# Altium project adc_brd_raton_v0.PrjPcb
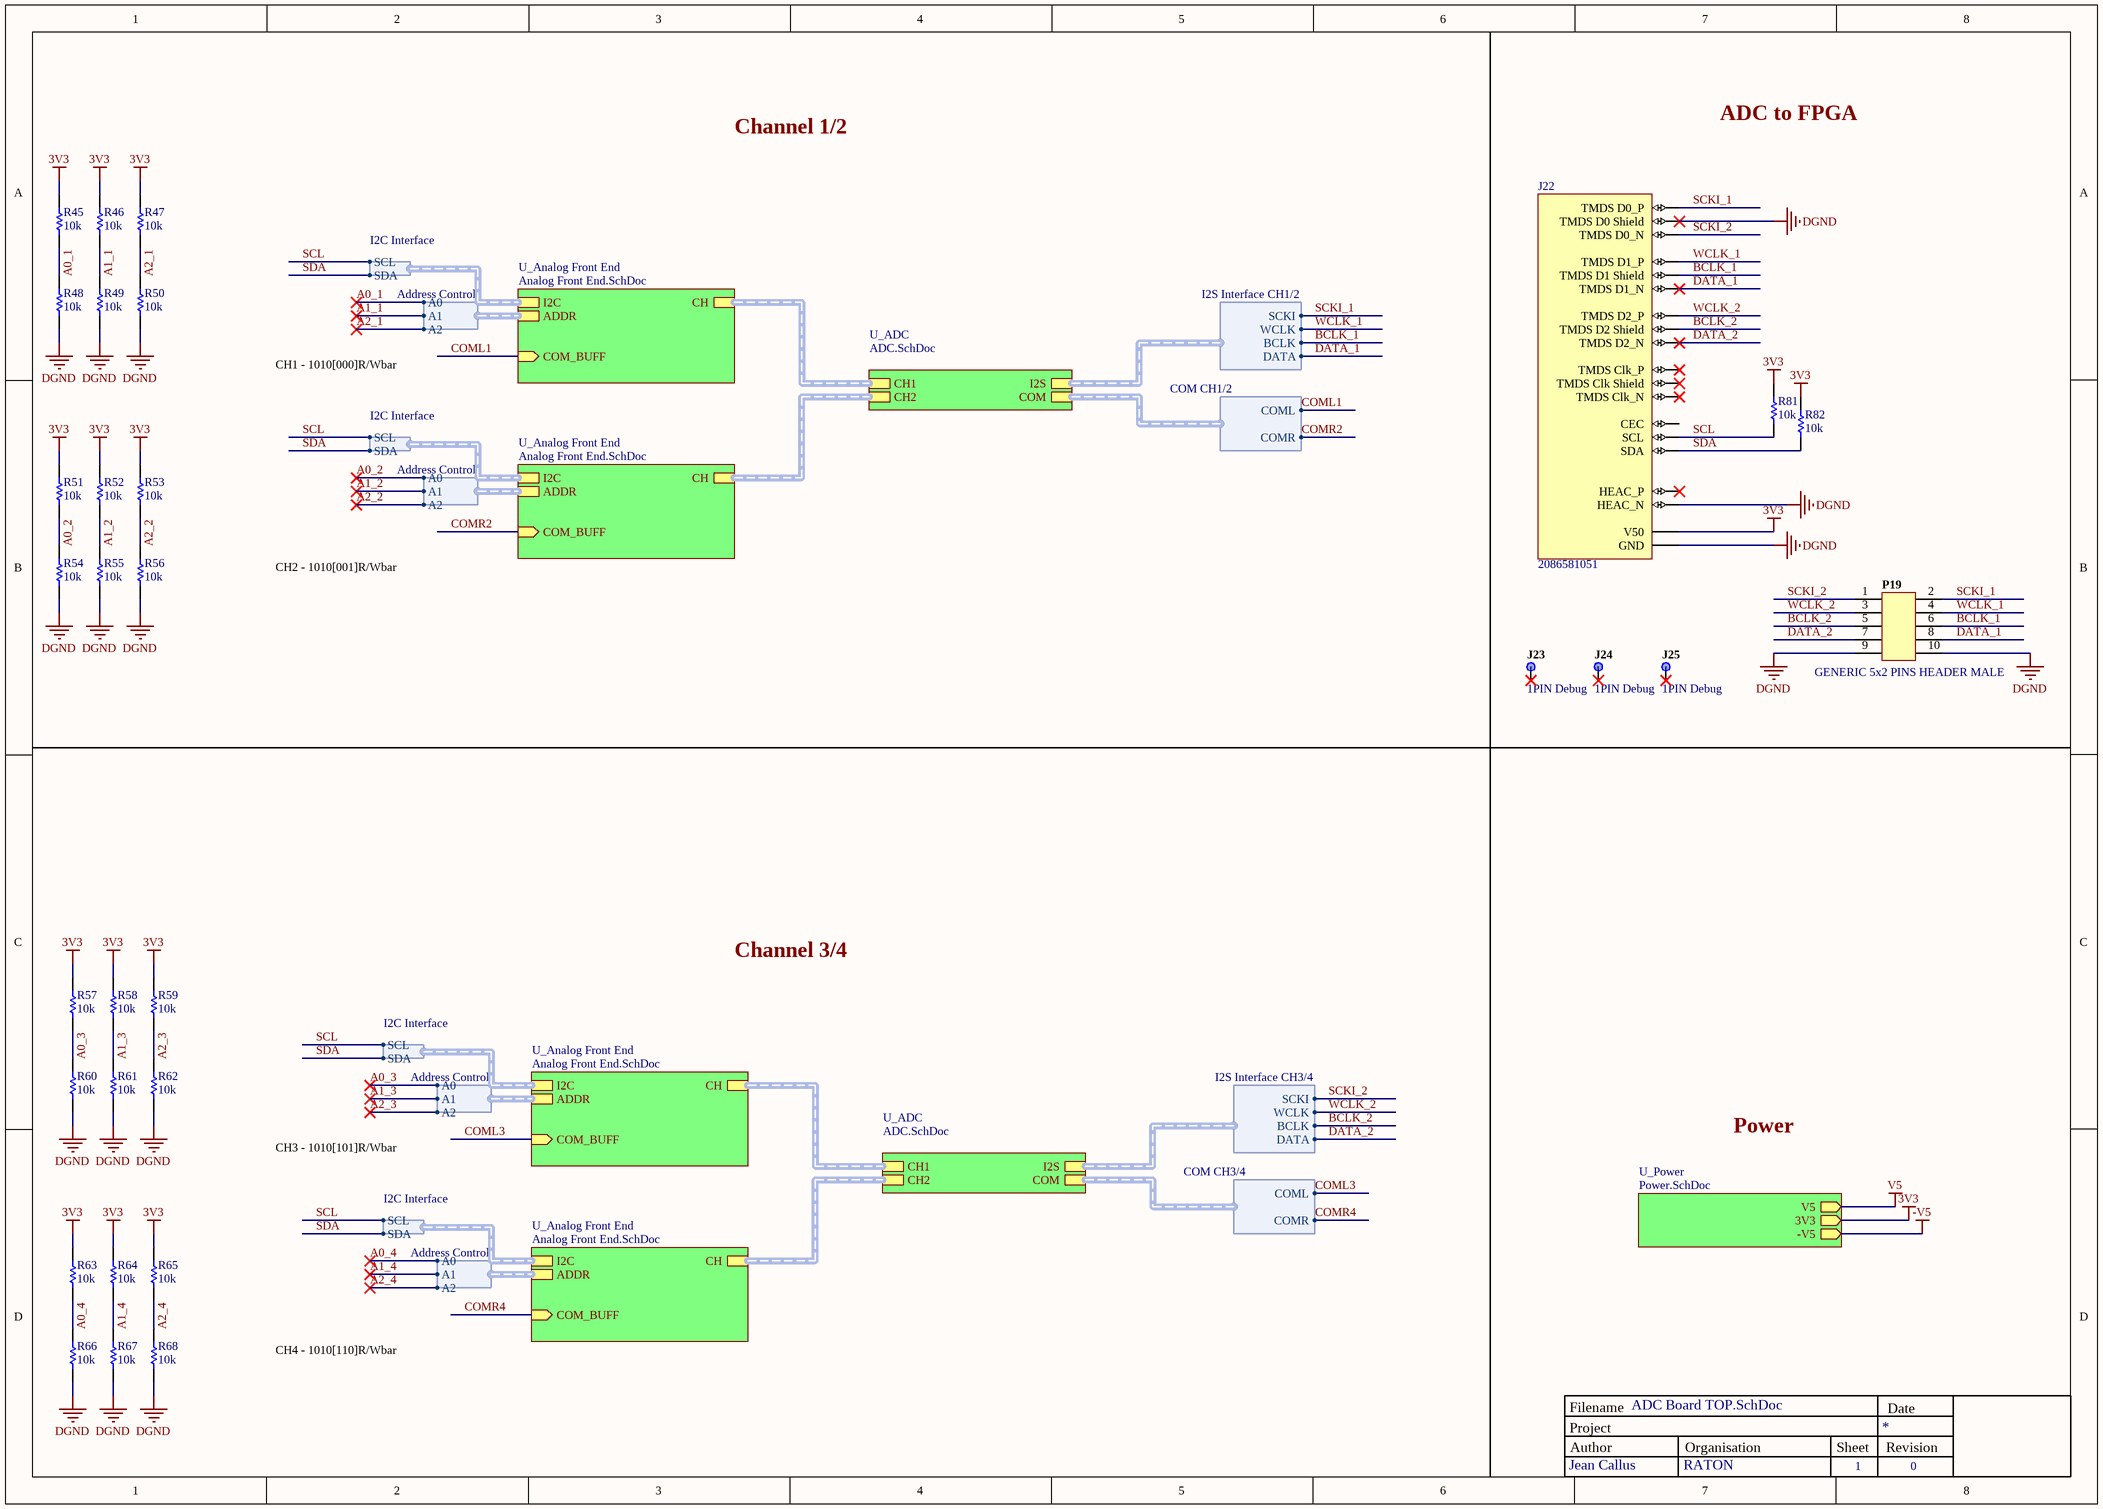
[diagram p0: ADC Board TOP.SchDoc]
4 sheets, 535 parts. Net scope: hierarchical (ports join the sheet entries above them; power ports are global).
Board file: adc_brd_raton_v0.PcbDoc
Sheets:
  ADC Board TOP.SchDoc
    U_Analog Front End = Analog Front End.SchDoc
    U_ADC = ADC.SchDoc
    U_Analog Front End = Analog Front End.SchDoc
    U_Power = Power.SchDoc
    U_Analog Front End = Analog Front End.SchDoc
    U_ADC = ADC.SchDoc
    U_Analog Front End = Analog Front End.SchDoc

## Sheet ADC Board TOP.SchDoc
size A3; Author: Jean Callus; Organization: RATON; Revision: 0; SheetNumber: 1

### Parts
J22  2086581051  [2086581051]
J23  1PIN Debug  [1 Pin Debug Port 0.9mm]
J24  1PIN Debug  [1 Pin Debug Port 0.9mm]
J25  1PIN Debug  [1 Pin Debug Port 0.9mm]
P19  GENERIC 5x2 PINS HEADER MALE  [GENERIC 5PIN 2ROW HEADER 0]
R45  value 10k  [0402-M]  (hidden comment: RES 10k 0402 63mW 5%)
R46  value 10k  [0402-M]  (hidden comment: RES 10k 0402 63mW 5%)
R47  value 10k  [0402-M]  (hidden comment: RES 10k 0402 63mW 5%)
R48  value 10k  [0402-M]  (hidden comment: RES 10k 0402 63mW 5%)
R49  value 10k  [0402-M]  (hidden comment: RES 10k 0402 63mW 5%)
R50  value 10k  [0402-M]  (hidden comment: RES 10k 0402 63mW 5%)
R51  value 10k  [0402-M]  (hidden comment: RES 10k 0402 63mW 5%)
R52  value 10k  [0402-M]  (hidden comment: RES 10k 0402 63mW 5%)
R53  value 10k  [0402-M]  (hidden comment: RES 10k 0402 63mW 5%)
R54  value 10k  [0402-M]  (hidden comment: RES 10k 0402 63mW 5%)
R55  value 10k  [0402-M]  (hidden comment: RES 10k 0402 63mW 5%)
R56  value 10k  [0402-M]  (hidden comment: RES 10k 0402 63mW 5%)
R57  value 10k  [0402-M]  (hidden comment: RES 10k 0402 63mW 5%)
R58  value 10k  [0402-M]  (hidden comment: RES 10k 0402 63mW 5%)
R59  value 10k  [0402-M]  (hidden comment: RES 10k 0402 63mW 5%)
R60  value 10k  [0402-M]  (hidden comment: RES 10k 0402 63mW 5%)
R61  value 10k  [0402-M]  (hidden comment: RES 10k 0402 63mW 5%)
R62  value 10k  [0402-M]  (hidden comment: RES 10k 0402 63mW 5%)
R63  value 10k  [0402-M]  (hidden comment: RES 10k 0402 63mW 5%)
R64  value 10k  [0402-M]  (hidden comment: RES 10k 0402 63mW 5%)
R65  value 10k  [0402-M]  (hidden comment: RES 10k 0402 63mW 5%)
R66  value 10k  [0402-M]  (hidden comment: RES 10k 0402 63mW 5%)
R67  value 10k  [0402-M]  (hidden comment: RES 10k 0402 63mW 5%)
R68  value 10k  [0402-M]  (hidden comment: RES 10k 0402 63mW 5%)
R81  value 10k  [0402-M]  (hidden comment: RES 10k 0402 63mW 5%)
R82  value 10k  [0402-M]  (hidden comment: RES 10k 0402 63mW 5%)

### Sub-sheets
U_ADC = ADC.SchDoc: I2S (harness I2S Interface CH1/2), CH1 (harness *), CH2 (harness *), COM (harness COM CH1/2)
U_ADC = ADC.SchDoc: I2S (harness I2S Interface CH3/4), CH1 (harness *), CH2 (harness *), COM (harness COM CH3/4)
U_Analog Front End = Analog Front End.SchDoc: COM_BUFF (in), CH (harness *), ADDR (harness Address Control), I2C (harness I2C Interface)
U_Analog Front End = Analog Front End.SchDoc: COM_BUFF (in), CH (harness *), ADDR (harness Address Control), I2C (harness I2C Interface)
U_Analog Front End = Analog Front End.SchDoc: COM_BUFF (in), CH (harness *), ADDR (harness Address Control), I2C (harness I2C Interface)
U_Analog Front End = Analog Front End.SchDoc: COM_BUFF (in), CH (harness *), ADDR (harness Address Control), I2C (harness I2C Interface)
U_Power = Power.SchDoc: V5 (out), 3V3 (out), -V5 (out)

### Harnesses
COM CH1/2: COML, COMR
COM CH3/4: COML, COMR
Address Control: A0, A1, A2
I2C Interface: SCL, SDA
I2S Interface CH1/2: SCKI, WCLK, BCLK, DATA
I2S Interface CH3/4: SCKI, WCLK, BCLK, DATA

### Nets
3V3: J22.18(V50) R45.2 R46.2 R47.2 R51.2 R52.2 R53.2 R57.2 R58.2 R59.2 R63.2 R64.2 R65.2 R81.2 R82.2 ; sheet U_Power/3V3
DGND: J22.8(TMDS_D0_Shield) J22.17(GND) J22.19(HEAC_N) P19.9 P19.10 R48.1 R49.1 R50.1 R54.1 R55.1 R56.1 R60.1 R61.1 R62.1 R66.1 R67.1 R68.1
A0_1: R45.1 R48.2 ; sheet U_Analog Front End/ADDR.A0  [project net A0]
A0_2: R51.1 R54.2 ; sheet U_Analog Front End/ADDR.A0  [project net A0]
A0_3: R57.1 R60.2 ; sheet U_Analog Front End/ADDR.A0  [project net A0]
A0_4: R63.1 R66.2 ; sheet U_Analog Front End/ADDR.A0  [project net A0]
A1_1: R46.1 R49.2 ; sheet U_Analog Front End/ADDR.A1  [project net A1]
A1_2: R52.1 R55.2 ; sheet U_Analog Front End/ADDR.A1  [project net A1]
A1_3: R58.1 R61.2 ; sheet U_Analog Front End/ADDR.A1  [project net A1]
A1_4: R64.1 R67.2 ; sheet U_Analog Front End/ADDR.A1  [project net A1]
A2_1: R47.1 R50.2 ; sheet U_Analog Front End/ADDR.A2  [project net A2]
A2_2: R53.1 R56.2 ; sheet U_Analog Front End/ADDR.A2  [project net A2]
A2_3: R59.1 R62.2 ; sheet U_Analog Front End/ADDR.A2  [project net A2]
A2_4: R65.1 R68.2 ; sheet U_Analog Front End/ADDR.A2  [project net A2]
BCLK_1: J22.5(TMDS_D1_Shield) P19.6 ; sheet U_ADC/I2S.BCLK  [project net BCLK]
BCLK_2: J22.2(TMDS_D2_Shield) P19.5 ; sheet U_ADC/I2S.BCLK  [project net BCLK]
COML1: sheet U_Analog Front End/COM_BUFF, sheet U_ADC/COM.COML  [project net COM]
COML3: sheet U_Analog Front End/COM_BUFF, sheet U_ADC/COM.COML  [project net COM]
COMR2: sheet U_Analog Front End/COM_BUFF, sheet U_ADC/COM.COMR  [project net COM]
COMR4: sheet U_Analog Front End/COM_BUFF, sheet U_ADC/COM.COMR  [project net COM]
DATA_1: J22.6(TMDS_D1_N) P19.8 ; sheet U_ADC/I2S.DATA  [project net DATA]
DATA_2: J22.3(TMDS_D2_N) P19.7 ; sheet U_ADC/I2S.DATA  [project net DATA]
SCKI_1: J22.7(TMDS_D0_P) P19.2 ; sheet U_ADC/I2S.SCKI  [project net SCKI]
SCKI_2: J22.9(TMDS_D0_N) P19.1 ; sheet U_ADC/I2S.SCKI  [project net SCKI]
SCL: J22.15(SCL) R81.1 ; sheet U_Analog Front End/I2C.SCL
SDA: J22.16(SDA) R82.1 ; sheet U_Analog Front End/I2C.SDA
WCLK_1: J22.4(TMDS_D1_P) P19.4 ; sheet U_ADC/I2S.WCLK  [project net WCLK]
WCLK_2: J22.1(TMDS_D2_P) P19.3 ; sheet U_ADC/I2S.WCLK  [project net WCLK]

Not connected (* = marked no-connect by the designer): J22 10(TMDS_Clk_P)* 11(TMDS_Clk_Shield)* 12(TMDS_Clk_N)* 13(CEC) 14(HEAC_P)*; J23 1*; J24 1*; J25 1*

### Buses and harness runs
harness sheet U_ADC/CH1 = sheet U_Analog Front End/CH
harness sheet U_ADC/CH2 = sheet U_Analog Front End/CH

### Notes on the sheet
- Channel 1/2
- ADC to FPGA
- CH1 - 1010[000]R/Wbar
- CH2 - 1010[001]R/Wbar
- Channel 3/4
- CH3 - 1010[101]R/Wbar
- Power
- CH4 - 1010[110]R/Wbar
- Project
- Filename
- Author
- Organisation
- Sheet
- Revision
- Date
  Date

### Library data of the parts
J22 = 2086581051-2: CONN FEM SMD 19 90Deg HDMI; Manufacturer: Molex; Status: Active; Supplier 1: Mouser; Source: Connector Library.SchLib; Design Item ID: 2086581051; Bin: *; Supplier Part Number 1: Mouser; Type: HYBRID; Case/Package: 4 PIN
J23-J25 = 1PIN Debug-2: CONN MAL TH 1 0Deg HEADER; Status: NC; Case/Package: 1 PIN; Source: Connector Library.SchLib; Type: N/A; Design Item ID: 1PIN Debug
P19 = GENERIC 5x2 PINS HEADER MALE-2: CONN MAL TH 5x2 0Deg HEADER; Bin: B3-J5; Status: Active; Case/Package: 2 PIN; Source: Connector Library.SchLib; Type: TH; Design Item ID: GENERIC 5x2 PINS HEADER MALE; Manufacturer: Generic
R45-R68 R81 R82 = RES 10k 0402 63mW 5%-1: RES-10k-0402-63mW-5%; Manufacturer: Generic; Bin: F1-R7-9; MAPPING: 1(2,1,11.5k); Design Item ID: RES 10k 0402 63mW 5%; Type: SMD; Status: Active; Case/Package: 0402; Source: Resistor Library.SchLib

## Sheet Analog Front End.SchDoc
size A3; Author: Jean Callus; CompanyName: RATON; DrawnBy: Jean Callus; Organization: RATON; Revision: 0; SheetNumber: 4; SheetTotal: 4; ImagePath: C:\Users\callu\Documents\University\Thesis\Misc\UoMLogo.jpg
Used 4 times, as channels U_Analog Front End, U_Analog Front End, U_Analog Front End, U_Analog Front End. Parts and nets are listed once, with the designators drawn on the sheet.
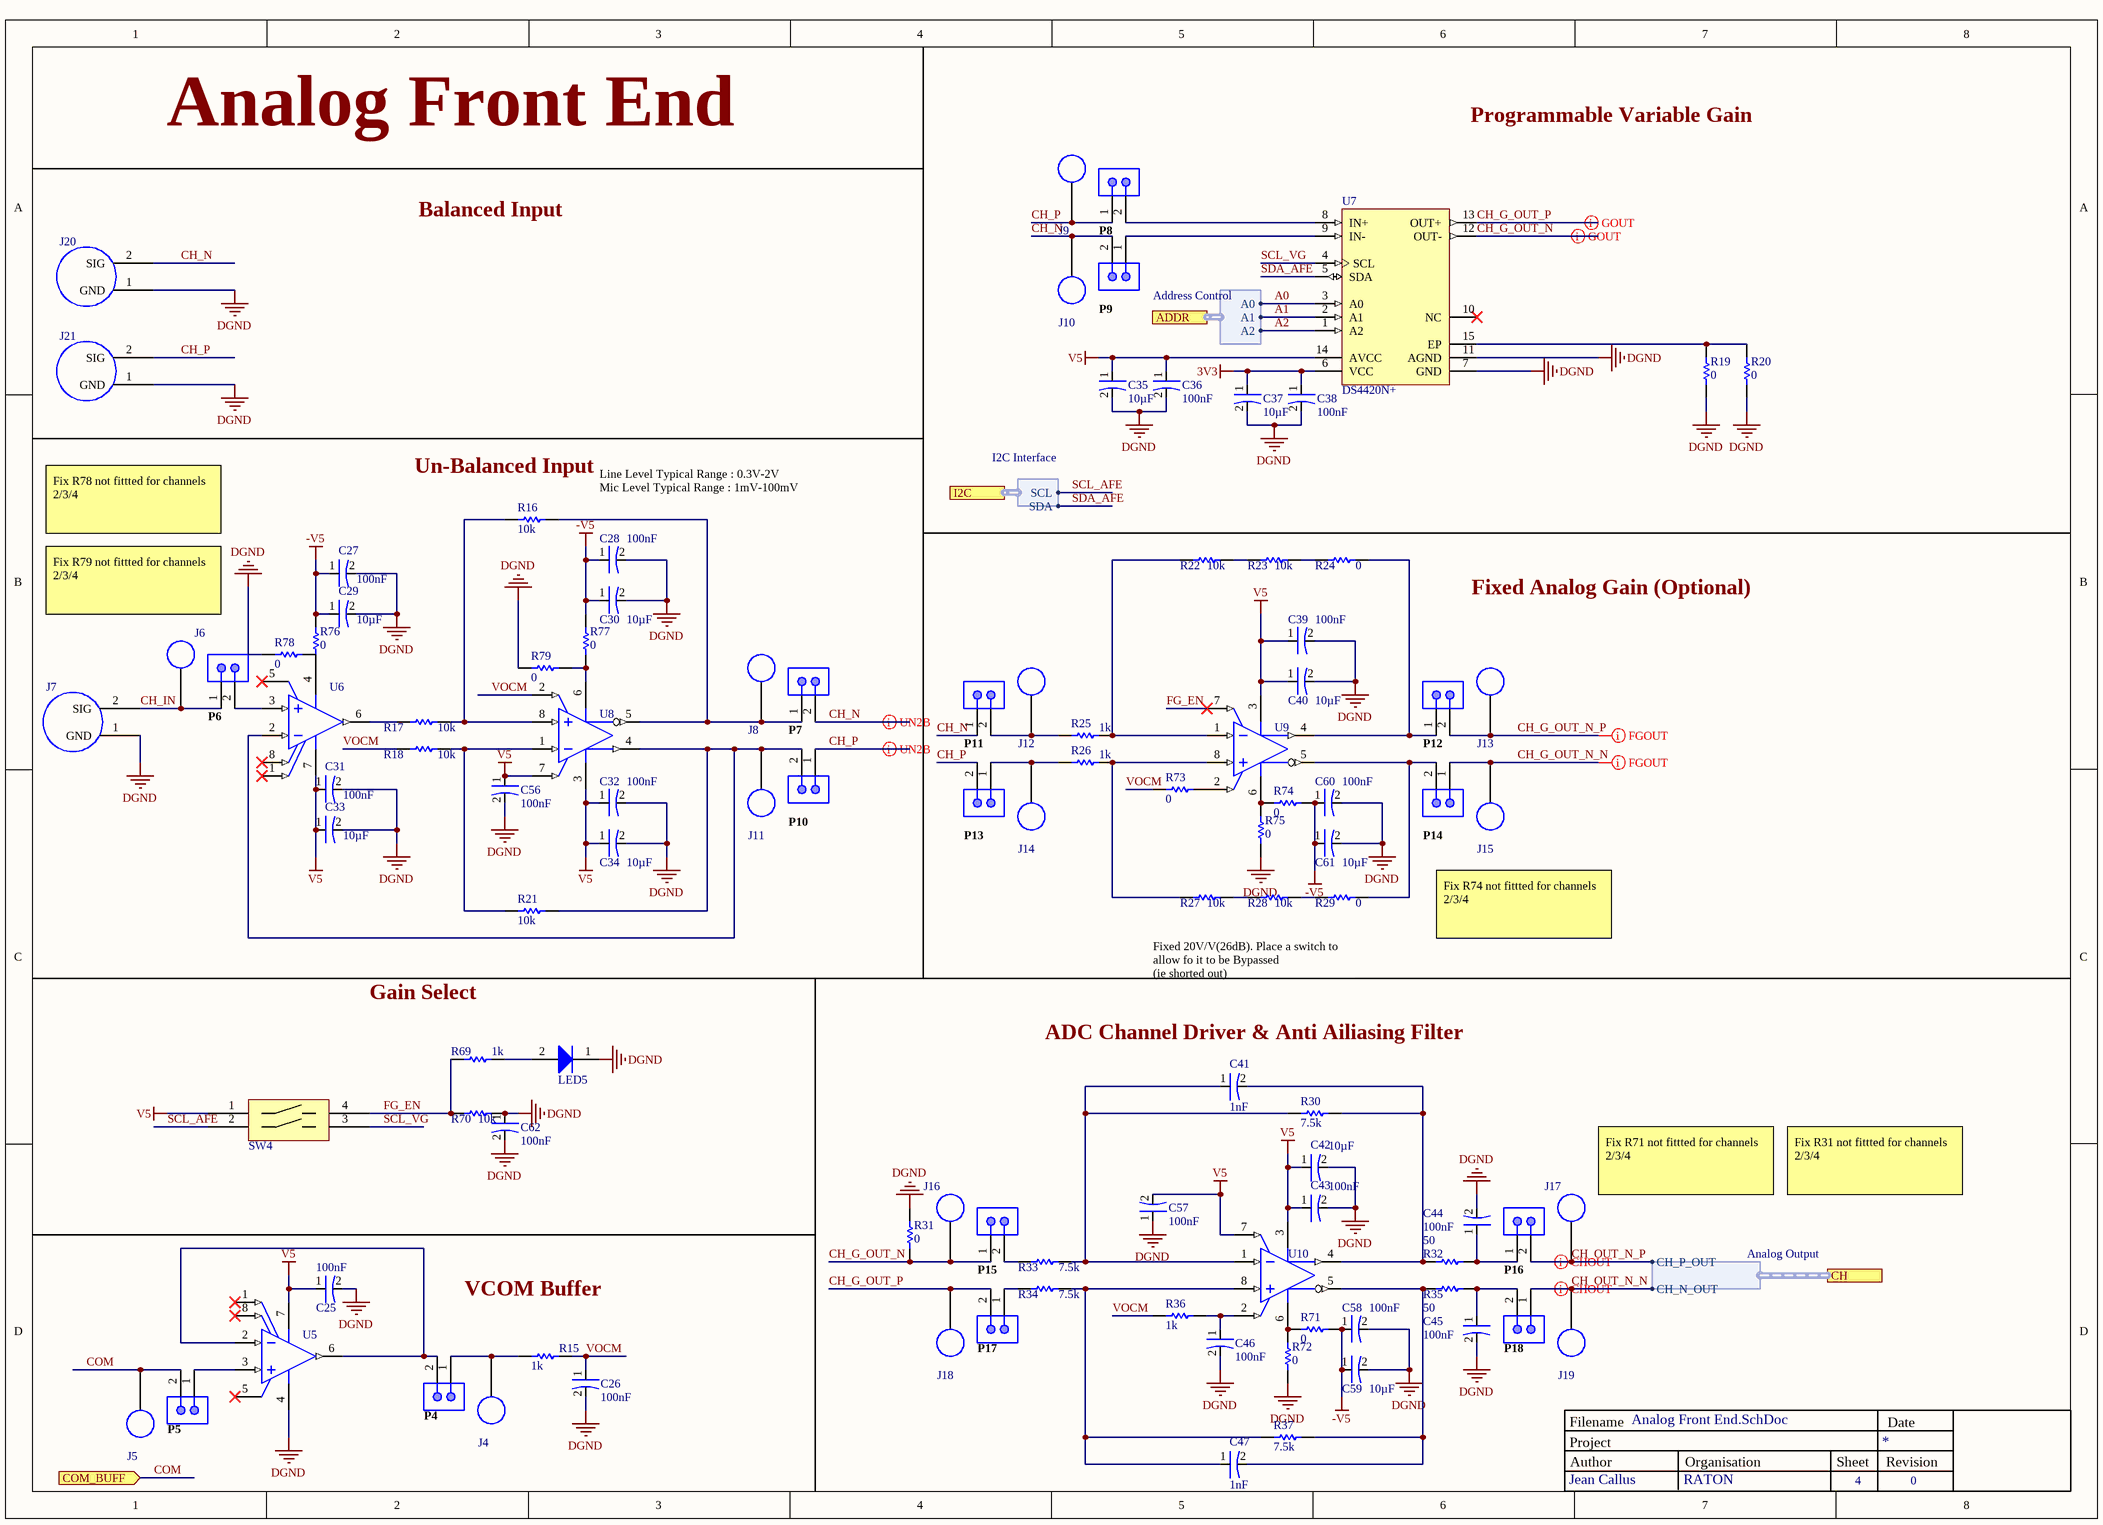
[diagram p1: Analog Front End.SchDoc]

### Parts
C25  value 100nF  [0805-M]  (hidden comment: CAP 0.1uF CER 0805 50V  X7R 5%)
C26  value 100nF  [0805-M]  (hidden comment: CAP 0.1uF CER 0805 50V  X7R 5%)
C27  value 100nF  [0805-M]  (hidden comment: CAP 0.1uF CER 0805 50V  X7R 5%)
C28  value 100nF  [0805-M]  (hidden comment: CAP 0.1uF CER 0805 50V  X7R 5%)
C29  value 10µF  [0805-M]  (hidden comment: CAP 10uF CER 0805 25V X5R 10%)
C30  value 10µF  [0805-M]  (hidden comment: CAP 10uF CER 0805 25V X5R 10%)
C31  value 100nF  [0805-M]  (hidden comment: CAP 0.1uF CER 0805 50V  X7R 5%)
C32  value 100nF  [0805-M]  (hidden comment: CAP 0.1uF CER 0805 50V  X7R 5%)
C33  value 10µF  [0805-M]  (hidden comment: CAP 10uF CER 0805 25V X5R 10%)
C34  value 10µF  [0805-M]  (hidden comment: CAP 10uF CER 0805 25V X5R 10%)
C35  value 10µF  [0805-M]  (hidden comment: CAP 10uF CER 0805 25V X5R 10%)
C36  value 100nF  [0805-M]  (hidden comment: CAP 0.1uF CER 0805 50V  X7R 5%)
C37  value 10µF  [0805-M]  (hidden comment: CAP 10uF CER 0805 25V X5R 10%)
C38  value 100nF  [0805-M]  (hidden comment: CAP 0.1uF CER 0805 50V  X7R 5%)
C39  value 100nF  [0805-M]  (hidden comment: CAP 0.1uF CER 0805 50V  X7R 5%)
C40  value 10µF  [0805-M]  (hidden comment: CAP 10uF CER 0805 25V X5R 10%)
C41  value 1nF  [0805-M]  (hidden comment: CAP 1nF CER 0805 25V X7R 5%)
C42  value 10µF  [0805-M]  (hidden comment: CAP 10uF CER 0805 25V X5R 10%)
C43  value 100nF  [0805-M]  (hidden comment: CAP 0.1uF CER 0805 50V  X7R 5%)
C44  value 100nF  [0805-M]  (hidden comment: CAP 0.1uF CER 0805 50V  X7R 5%)
C45  value 100nF  [0805-M]  (hidden comment: CAP 0.1uF CER 0805 50V  X7R 5%)
C46  value 100nF  [0805-M]  (hidden comment: CAP 0.1uF CER 0805 50V  X7R 5%)
C47  value 1nF  [0805-M]  (hidden comment: CAP 1nF CER 0805 25V X7R 5%)
C56  value 100nF  [0805-M]  (hidden comment: CAP 0.1uF CER 0805 50V  X7R 5%)
C57  value 100nF  [0805-M]  (hidden comment: CAP 0.1uF CER 0805 50V  X7R 5%)
C58  value 100nF  [0805-M]  (hidden comment: CAP 0.1uF CER 0805 50V  X7R 5%)
C59  value 10µF  [0805-M]  (hidden comment: CAP 10uF CER 0805 25V X5R 10%)
C60  value 100nF  [0805-M]  (hidden comment: CAP 0.1uF CER 0805 50V  X7R 5%)
C61  value 10µF  [0805-M]  (hidden comment: CAP 10uF CER 0805 25V X5R 10%)
C62  value 100nF  [0805-M]  (hidden comment: CAP 0.1uF CER 0805 50V  X7R 5%)
J4  151-203-RC  [151-203-RC-Footprint-1]  (value not drawn)
J5  151-203-RC  [151-203-RC-Footprint-1]  (value not drawn)
J6  151-203-RC  [151-203-RC-Footprint-1]  (value not drawn)
J7  SMA CONNECTOR  [SMA CONNECTOR-Footprint-1]  (value not drawn)
J8  151-203-RC  [151-203-RC-Footprint-1]  (value not drawn)
J9  151-203-RC  [151-203-RC-Footprint-1]  (value not drawn)
J10  151-203-RC  [151-203-RC-Footprint-1]  (value not drawn)
J11  151-203-RC  [151-203-RC-Footprint-1]  (value not drawn)
J12  151-203-RC  [151-203-RC-Footprint-1]  (value not drawn)
J13  151-203-RC  [151-203-RC-Footprint-1]  (value not drawn)
J14  151-203-RC  [151-203-RC-Footprint-1]  (value not drawn)
J15  151-203-RC  [151-203-RC-Footprint-1]  (value not drawn)
J16  151-203-RC  [151-203-RC-Footprint-1]  (value not drawn)
J17  151-203-RC  [151-203-RC-Footprint-1]  (value not drawn)
J18  151-203-RC  [151-203-RC-Footprint-1]  (value not drawn)
J19  151-203-RC  [151-203-RC-Footprint-1]  (value not drawn)
J20  SMA CONNECTOR  [SMA CONNECTOR-Footprint-1]  (value not drawn)
J21  SMA CONNECTOR  [SMA CONNECTOR-Footprint-1]  (value not drawn)
LED5  LED 0603 Red 20mA 1.7V  [0603 Generic]  (value not drawn)
P4  GENERIC 2PIN HEADER MALE  [GENERIC 2PIN HEADER 0]  (value not drawn)
P5  GENERIC 2PIN HEADER MALE  [GENERIC 2PIN HEADER 0]  (value not drawn)
P6  GENERIC 2PIN HEADER MALE  [GENERIC 2PIN HEADER 0]  (value not drawn)
P7  GENERIC 2PIN HEADER MALE  [GENERIC 2PIN HEADER 0]  (value not drawn)
P8  GENERIC 2PIN HEADER MALE  [GENERIC 2PIN HEADER 0]  (value not drawn)
P9  GENERIC 2PIN HEADER MALE  [GENERIC 2PIN HEADER 0]  (value not drawn)
P10  GENERIC 2PIN HEADER MALE  [GENERIC 2PIN HEADER 0]  (value not drawn)
P11  GENERIC 2PIN HEADER MALE  [GENERIC 2PIN HEADER 0]  (value not drawn)
P12  GENERIC 2PIN HEADER MALE  [GENERIC 2PIN HEADER 0]  (value not drawn)
P13  GENERIC 2PIN HEADER MALE  [GENERIC 2PIN HEADER 0]  (value not drawn)
P14  GENERIC 2PIN HEADER MALE  [GENERIC 2PIN HEADER 0]  (value not drawn)
P15  GENERIC 2PIN HEADER MALE  [GENERIC 2PIN HEADER 0]  (value not drawn)
P16  GENERIC 2PIN HEADER MALE  [GENERIC 2PIN HEADER 0]  (value not drawn)
P17  GENERIC 2PIN HEADER MALE  [GENERIC 2PIN HEADER 0]  (value not drawn)
P18  GENERIC 2PIN HEADER MALE  [GENERIC 2PIN HEADER 0]  (value not drawn)
R15  value 1k  [0805-M]  (hidden comment: RES 1k 0805 125mW 5%)
R16  value 10k  [0402-M]  (hidden comment: RES 10k 0402 63mW 5%)
R17  value 10k  [0402-M]  (hidden comment: RES 10k 0402 63mW 5%)
R18  value 10k  [0402-M]  (hidden comment: RES 10k 0402 63mW 5%)
R19  value 0  [0402-M]  (hidden comment: RES 0 0402 63mW)
R20  value 0  [0402-M]  (hidden comment: RES 0 0402 63mW)
R21  value 10k  [0402-M]  (hidden comment: RES 10k 0402 63mW 5%)
R22  value 10k  [0805-M]  (hidden comment: RES 10k 0805 125mW 1%)
R23  value 10k  [0805-M]  (hidden comment: RES 10k 0805 125mW 1%)
R24  value 0  [0402-M]  (hidden comment: RES 0 0402 63mW)
R25  value 1k  [0805-M]  (hidden comment: RES 1k 0805 125mW 5%)
R26  value 1k  [0805-M]  (hidden comment: RES 1k 0805 125mW 5%)
R27  value 10k  [0805-M]  (hidden comment: RES 10k 0805 125mW 1%)
R28  value 10k  [0805-M]  (hidden comment: RES 10k 0805 125mW 1%)
R29  value 0  [0402-M]  (hidden comment: RES 0 0402 63mW)
R30  value 7.5k  [0402-M]  (hidden comment: RES 7.5k 0402 63mW 5%)
R31  value 0  [0402-M]  (hidden comment: RES 0 0402 63mW)
R32  value 50  [0805-L]  (hidden comment: RES 50 0805 125mW 1%)
R33  value 7.5k  [0402-M]  (hidden comment: RES 7.5k 0402 63mW 5%)
R34  value 7.5k  [0402-M]  (hidden comment: RES 7.5k 0402 63mW 5%)
R35  value 50  [0805-L]  (hidden comment: RES 50 0805 125mW 1%)
R36  value 1k  [0805-M]  (hidden comment: RES 1k 0805 125mW 5%)
R37  value 7.5k  [0402-M]  (hidden comment: RES 7.5k 0402 63mW 5%)
R69  value 1k  [0805-M]  (hidden comment: RES 1k 0805 125mW 5%)
R70  value 10k  [0805-M]  (hidden comment: RES 10k 0805 125mW 1%)
R71  value 0  [0402-M]  (hidden comment: RES 0 0402 63mW)
R72  value 0  [0402-M]  (hidden comment: RES 0 0402 63mW)
R73  value 0  [0402-M]  (hidden comment: RES 0 0402 63mW)
R74  value 0  [0402-M]  (hidden comment: RES 0 0402 63mW)
R75  value 0  [0402-M]  (hidden comment: RES 0 0402 63mW)
R76  value 0  [0402-M]  (hidden comment: RES 0 0402 63mW)
R77  value 0  [0402-M]  (hidden comment: RES 0 0402 63mW)
R78  value 0  [0402-M]  (hidden comment: RES 0 0402 63mW)
R79  value 0  [0402-M]  (hidden comment: RES 0 0402 63mW)
SW4  210-2MS  [210-2MS-Footprint-1]  (value not drawn)
U5  OPA227UA/2K5  [D0008A_L]  (value not drawn)
U6  OPA227UA/2K5  [D0008A_L]  (value not drawn)
U7  DS4420N+  [QFN50P400X300X75_HS-15N]
U8  OPA1632DR  [D0008A_L]  (value not drawn)
U9  OPA1632DR  [D0008A_L]  (value not drawn)
U10  OPA1632DR  [D0008A_L]  (value not drawn)

### Ports
ADDR (harness Address Control), CH (harness Analog Output), COM_BUFF (in), I2C (harness I2C Interface)

### Harnesses
Analog Output: CH_P_OUT, CH_N_OUT
Address Control: A0, A1, A2
I2C Interface: SCL, SDA

### Nets
3V3: C37.1(Anode) C38.1(Anode) U7.6(VCC)
-V5: C27.1(Anode) C28.1(Anode) C29.1(Anode) C30.1(Anode) C58.1(Anode) C59.1(Anode) C60.1(Anode) C61.1(Anode) R71.2 R74.1 R76.1 R77.2
DGND: C25.2(Cathode) C26.2(Cathode) C27.2(Cathode) C28.2(Cathode) C29.2(Cathode) C30.2(Cathode) C31.2(Cathode) C32.2(Cathode) C33.2(Cathode) C34.2(Cathode) C35.2(Cathode) C36.2(Cathode) C37.2(Cathode) C38.2(Cathode) C39.2(Cathode) C40.2(Cathode) C42.2(Cathode) C43.2(Cathode) C44.2(Cathode) C45.2(Cathode) C46.2(Cathode) C56.2(Cathode) C57.1(Anode) C58.2(Cathode) C59.2(Cathode) C60.2(Cathode) C61.2(Cathode) C62.1(Anode) C62.2(Cathode) J7.1(GND) J20.1(GND) J21.1(GND) LED5.1 R19.1 R20.1 R31.1 R70.2 R72.1 R75.2 R78.1 R79.1 U5.4(V-) U7.7(GND) U7.11(AGND)
V5: C25.1(Anode) C31.1(Anode) C32.1(Anode) C33.1(Anode) C34.1(Anode) C35.1(Anode) C36.1(Anode) C39.1(Anode) C40.1(Anode) C42.1(Anode) C43.1(Anode) C56.1(Anode) C57.2(Cathode) SW4.1 U5.7(V+) U6.7(V+) U7.14(AVCC) U8.3(V+) U8.7(ENABLE) U9.3(V+) U10.3(V+) U10.7(ENABLE)
A0: U7.3(A0) ; port ADDR.A0
A1: U7.2(A1) ; port ADDR.A1
A2: U7.1(A2) ; port ADDR.A2
CH_G_OUT_N: J16.1 P15.1 R31.2 U7.12(OUT-)
CH_G_OUT_N_N: J15.1 P14.1
CH_G_OUT_N_P: J13.1 P12.2
CH_G_OUT_P: J18.1 P17.2 U7.13(OUT+)
CH_IN: J6.1 J7.2(SIG) P6.1
CH_N: J10.1 J20.2(SIG) P7.2 P9.2 P11.1
CH_OUT_N_N: J19.1 P18.1 ; port CH.CH_N_OUT
CH_OUT_N_P: J17.1 P16.2 ; port CH.CH_P_OUT
CH_P: J9.1 J21.2(SIG) P8.1 P10.1 P13.2
COM: J5.1 P5.2 ; port COM_BUFF
FG_EN: R69.1 R70.1 SW4.4 U9.7(ENABLE)
SCL_AFE: SW4.2 ; port I2C.SCL
SCL_VG: SW4.3 U7.4(SCL)
SDA_AFE: U7.5(SDA) ; port I2C.SDA
VOCM: C26.1(Anode) R15.2 R18.1 R36.1 R73.2 U8.2(VOCM)
NetC41_1: C41.1(Anode) R30.1 R33.2 U10.1(VIN-)
NetC41_2: C41.2(Cathode) R30.2 R32.1 U10.4(VOUT+)
NetC44_1: C44.1(Anode) P16.1 R32.2
NetC45_1: C45.1(Anode) P18.2 R35.2
NetC46_1: C46.1(Anode) R36.2 U10.2(VOCM)
NetC47_1: C47.1(Anode) R34.2 R37.1 U10.8(VIN+)
NetC47_2: C47.2(Cathode) R35.1 R37.2 U10.5(VOUT-)
NetJ4_1: J4.1 P4.1 R15.1
NetJ8_1: J8.1 P7.1 R16.2 U8.5(VOUT-)
NetJ11_1: J11.1 P10.2 R21.2 U6.2(IN-) U8.4(VOUT+)
NetJ12_1: J12.1 P11.2 R25.2
NetJ14_1: J14.1 P13.1 R26.2
NetLED5_2: LED5.2 R69.2
NetP4_2: P4.2 U5.2(IN-) U5.6(OUT)
NetP5_1: P5.1 U5.3(IN+)
NetP6_2: P6.2 U6.3(IN+)
NetP8_2: P8.2 U7.8(IN+)
NetP9_1: P9.1 U7.9(IN-)
NetP12_1: P12.1 R24.2 U9.4(VOUT+)
NetP14_2: P14.2 R29.2 U9.5(VOUT-)
NetP15_2: P15.2 R33.1
NetP17_1: P17.1 R34.1
NetR16_1: R16.1 R17.2 U8.8(VIN+)
NetR17_1: R17.1 U6.6(OUT)
NetR18_2: R18.2 R21.1 U8.1(VIN-)
NetR19_2: R19.2 R20.2 U7.15(EP)
NetR22_1: R22.1 R25.1 U9.1(VIN-)
NetR22_2: R22.2 R23.1
NetR23_2: R23.2 R24.1
NetR26_1: R26.1 R27.1 U9.8(VIN+)
NetR27_2: R27.2 R28.1
NetR28_2: R28.2 R29.1
NetR71_1: R71.1 R72.2 U10.6(V-)
NetR73_1: R73.1 U9.2(VOCM)
NetR74_2: R74.2 R75.1 U9.6(V-)
NetR76_2: R76.2 U6.4(V-)
NetR77_1: R77.1 R79.2 U8.6(V-)

Not connected (* = marked no-connect by the designer): R78 2; U5 1(TRIM)* 5(NC)* 8(TRIM)*; U6 1(TRIM)* 5(NC)* 8(TRIM)*; U7 10(NC)*

### Channels
U_Analog Front End: designators end in _1; ports COM_BUFF=COM
U_Analog Front End: designators end in _2; ports COM_BUFF=COM
U_Analog Front End: designators end in _3; ports COM_BUFF=COM
U_Analog Front End: designators end in _4; ports COM_BUFF=COM

### Layout directives
differential pair: CH_G_OUT_N_N_U_Analog Front End, CH_G_OUT_N_P_U_Analog Front End, CH_G_OUT_N_U_Analog Front End, CH_G_OUT_P_U_Analog Front End, CH_N_U_Analog Front End, CH_OUT_N_N, CH_OUT_N_P, CH_P_U_Analog Front End

### Notes on the sheet
- Analog Front End
- Programmable Variable Gain
- Balanced Input
- (near R16) Un-Balanced Input
- Fix R78 not fittted for channels 2/3/4
- Line Level Typical Range : 0.3V-2V
  Mic Level Typical Range : 1mV-100mV
- Fixed Analog Gain (Optional)
- Fix R79 not fittted for channels 2/3/4
- Fix R74 not fittted for channels 2/3/4
- Gain Select
- Fixed 20V/V(26dB). Place a switch to allow fo it to be Bypassed
  (ie shorted out)
- (near C41) ADC Channel Driver & Anti Ailiasing Filter
- (near J17) Fix R71 not fittted for channels 2/3/4
- Fix R31 not fittted for channels 2/3/4
- VCOM Buffer
- Project
- Filename
- Author
- Organisation
- Sheet
- Revision
- Date
  Date

### Library data of the parts
C25-C28 C31 C32 C36 C38 C39 C43-C46 C56-C58 C60 C62 = CAP 0.1uF CER 0805 50V  X7R 5%-2: CAP-0.1uF-CER-0805-50V- X7R-5%; Manufacturer: Generic; Bin: F1-C6-4; Type: SMD; Design Item ID: CAP 0.1uF CER 0805 50V  X7R 5%; Supplier 1: Mouser; Datasheet: http://www.kemet.com/Lists/ProductCatalog/Attachments/53/KEM_C1002_X7R_SMD.pdf; Source: Capacitor Library.SchLib; Case/Package: 0805; Status: Active; Supplier Part Number 1: 80-C0805C104J3R
C29 C30 C33-C35 C37 C40 C42 C59 C61 = CAP 10uF CER 0805 25V X5R 10%-2: CAP-10uF-CER-0805-25V-X5R-10%; Manufacturer: Generic; Type: SMD; Bin: F1-C1-4; Supplier 1: Mouser; Case/Package: 0805; Source: Capacitor Library.SchLib; Supplier Part Number 1: 80-C0805C106K8P; Status: Active; Design Item ID: CAP 10uF CER 0805 25V X5R 10%
C41 C47 = CAP 1nF CER 0805 25V X7R 5%-2: Manufacturer: Generic; Bin: N; Type: SMD; Source: Capacitor Library.SchLib; Datasheet: http://www.mouser.com/ds/2/212/KEM_C1002_X7R_SMD-357932.pdf; Supplier 1: Mouser; Status: Active; Design Item ID: CAP 1nF CER 0805 25V X7R 5%; Supplier Part Number 1: 77-VJ0805Y102JXXPBC; Case/Package: 0805
J4-J6 J8-J19 = CMP-002-00000-2: PCB-Probe-Ring; Color: Black
J7 J20 J21 = CMP-002-00001-2: Manufacturer: LPRS; Connector Type: SMA,Coaxial; Max Frequency: 6GHz; Impedance: 50R; Supplier No: 471-SMACONNECTOR; Contact Material: Gold; Supplier: Mouser; REACH SVHC: No SVHC; Case/Package: SMA; Contact Plating: Gold
LED5 = LED 0603 Red 20mA 1.7V-1: LED-0603-Red-20mA-1.7V-STOCK; Manufacturer: Generic; Bin: F2-DM1-2; Type: SMD; Supplier Part Number 1: 67-1551-6-ND; Design Item ID: LED 0603 Red 20mA 1.7V; Status: Active; Case/Package: 0603; Source: Diode Library.SchLib; Supplier 1: Digi-Key
P4-P18 = GENERIC 2PIN HEADER MALE-2: CONN MAL TH 2 0Deg HEADER; Bin: B3-J5; Manufacturer: Generic; Design Item ID: GENERIC 2PIN HEADER MALE; Type: TH; Status: Active; Source: Connector Library.SchLib; Case/Package: n/a PIN
R15 R25 R26 R36 R69 = RES 1k 0805 125mW 5%-1: RES-1k-0805-125mW-5%; Manufacturer: Generic; Bin: F1-R12-6; MAPPING: 1(2,1,30.9k); Design Item ID: RES 1k 0805 125mW 5%; Case/Package: 0805; Status: Active; Source: Resistor Library.SchLib; Type: SMD
R16-R18 R21 = RES 10k 0402 63mW 5%-1: as R45 on sheet ADC Board TOP; Design Item ID: RES 10k 0402 63mW 5%; Type: SMD; Status: Active; Case/Package: 0402; Source: Resistor Library.SchLib
R19 R20 R24 R29 R31 R71-R79 = RES 0 0402 63mW-1: RES-0-0402-63mW-5%; Manufacturer: Generic; MAPPING: 1(2,1,11.5k); Bin: F1-RM1-5; Source: Resistor Library.SchLib; Design Item ID: RES 0 0402 63mW; Case/Package: 0402; Type: SMD; Status: Active
R22 R23 R27 R28 R70 = RES 10k 0805 125mW 1%-1: RES-10k-0805-125mW-1%; Manufacturer: Generic; MAPPING: 1(2,1,10k); Bin: F1-R12-10; Design Item ID: RES 10k 0805 125mW 1%; Case/Package: 0805; Type: SMD; Status: Active; Source: Resistor Library.SchLib
R30 R33 R34 R37 = RES 7.5k 0402 63mW 5%-1: RES-7.5k-0402-63mW-5%; Manufacturer: Generic; Bin: F1-R3-1; MAPPING: 1(2,1,11.5k); Type: SMD; Status: Active; Case/Package: 0402; Design Item ID: RES 7.5k 0402 63mW 5%; Source: Resistor Library.SchLib
R32 R35 = RES 50 0805 125mW 1%-1: RES-50-0805-125mW-1%; Manufacturer: Generic; MAPPING: 1(2,1,30.9k); Bin: F1-R9-6; Design Item ID: RES 50 0805 125mW 1%; Case/Package: 0805; Type: SMD; Status: Active; Source: Resistor Library.SchLib
SW4 = CMP-01293-3: SWITCH DIP SPST 2 100mA 50V; Actuator Type: Slide (Standard); Electrical Life: 1000Cycles; Number of Positions: 2; Washable: No; Pitch: 0.1inch; Voltage Rating (DC): 20V; Terminal Pitch: 2.54mm; Contact Material: Copper; Length: 0.258inch; Termination: PC Pin; Lead Free: Lead Free; Max Current Rating: 100mA; Throw Configuration: SPST; Packaging: Rail/Tube; Current Rating: 100mA; Orientation: Straight; Min Operating Temperature: -40°C; Contact Plating: Gold,Tin; Max Operating Temperature: 85°C; Package Quantity: 85; Mount: Through Hole
U5 U6 = CMP-019-00001-1: IC OPAMP GP 8MHZ 8SOIC; Slew Rate: 2.3V/µs; Input Bias Current: 10nA; Max Supply Voltage: 18V; Input Offset Voltage (Vos): 200uV; Operating Supply Current: 3.7mA; Number of Circuits: 1; Output Current per Channel: 45mA; Nominal Supply Current: 3.8mA; Common Mode Rejection Ratio: 120dB; Voltage Gain: 160dB; Power Supply Rejection Ratio (PSRR): 126.02dB; Min Dual Supply Voltage: 2.5V; Number of Pins: 8; Radiation Hardening: No; Max Dual Supply Voltage: 18V; Packaging: Tape and Reel; Max I/O Voltage: 200uV; Contact Plating: Gold; Number of Channels: 1; Case/Package: D; Gain Bandwidth Product: 8MHz; Min Operating Temperature: -40°C; Nominal Gain Bandwidth Product: 8MHz; Max Operating Temperature: 85°C; Unity Gain Bandwidth Product: 8MHz; Output Current: 45mA; Bandwidth: 8MHz; Package Quantity: 2500; Number of Elements: 1; Lead Free: Lead Free
U7 = CMP-01300-2: Maxim DS4420N+, Programmable Gain Amplifier 67dB, 14-Pin TDFN; Bandwidth: 20kHz; Min Supply Voltage: 4.5V; Power Supply Rejection Ratio (PSRR): 90dB; Number of Amplifiers: 1; Nominal Supply Current: 1.7mA; Max Supply Voltage: 5.5V; Length: 3mm; REACH SVHC: Unknown; Features: I²C; Packaging: Rail/Tube; Height: 0.75mm; Radiation Hardening: No; Min Operating Temperature: -20°C; Width: 3mm; Max Operating Temperature: 70°C; Package Quantity: 100; Number of Pins: 14
U8-U10 = CMP-019-00002-1: IC OPAMP AUDIO 180MHZ 8SOIC; Operating Supply Current: 14mA; Min Supply Voltage: 5V; Voltage Gain: 78dB; Max Supply Voltage: 32V; Max Dual Supply Voltage: 16V; Number of Circuits: 1; Output Current: 85mA; Power Supply Rejection Ratio (PSRR): 70dB; Input Offset Voltage (Vos): 3mV; Min Dual Supply Voltage: 2.5V; Common Mode Rejection Ratio: 74dB; Slew Rate: 50V/µs; Dual Supply Voltage: 15V; Max Power Dissipation: 2W; Input Bias Current: 2uA; Supply Type: Single,Dual; Gain Bandwidth Product: 180MHz; Package Quantity: 2500; Case/Package: D; Bandwidth: 180MHz; Nominal Gain Bandwidth Product: 180MHz; -3db Bandwidth: 180MHz; Number of Pins: 8; Number of Elements: 1; Output Current per Channel: 85mA; Radiation Hardening: No; Number of Channels: 1; Nominal Supply Current: 14mA; Gain: 78dB; Max Operating Temperature: 85°C; Weight: 0.002677oz; Packaging: Tape and Reel; Min Operating Temperature: -40°C; Lead Free: Lead Free; Contact Plating: Gold

## Sheet ADC.SchDoc
size A3; Author: Jean Callus; Engineer: Jean Callus; Organization: RATON; Revision: 0; SheetNumber: 2
Used 2 times, as channels U_ADC, U_ADC. Parts and nets are listed once, with the designators drawn on the sheet.
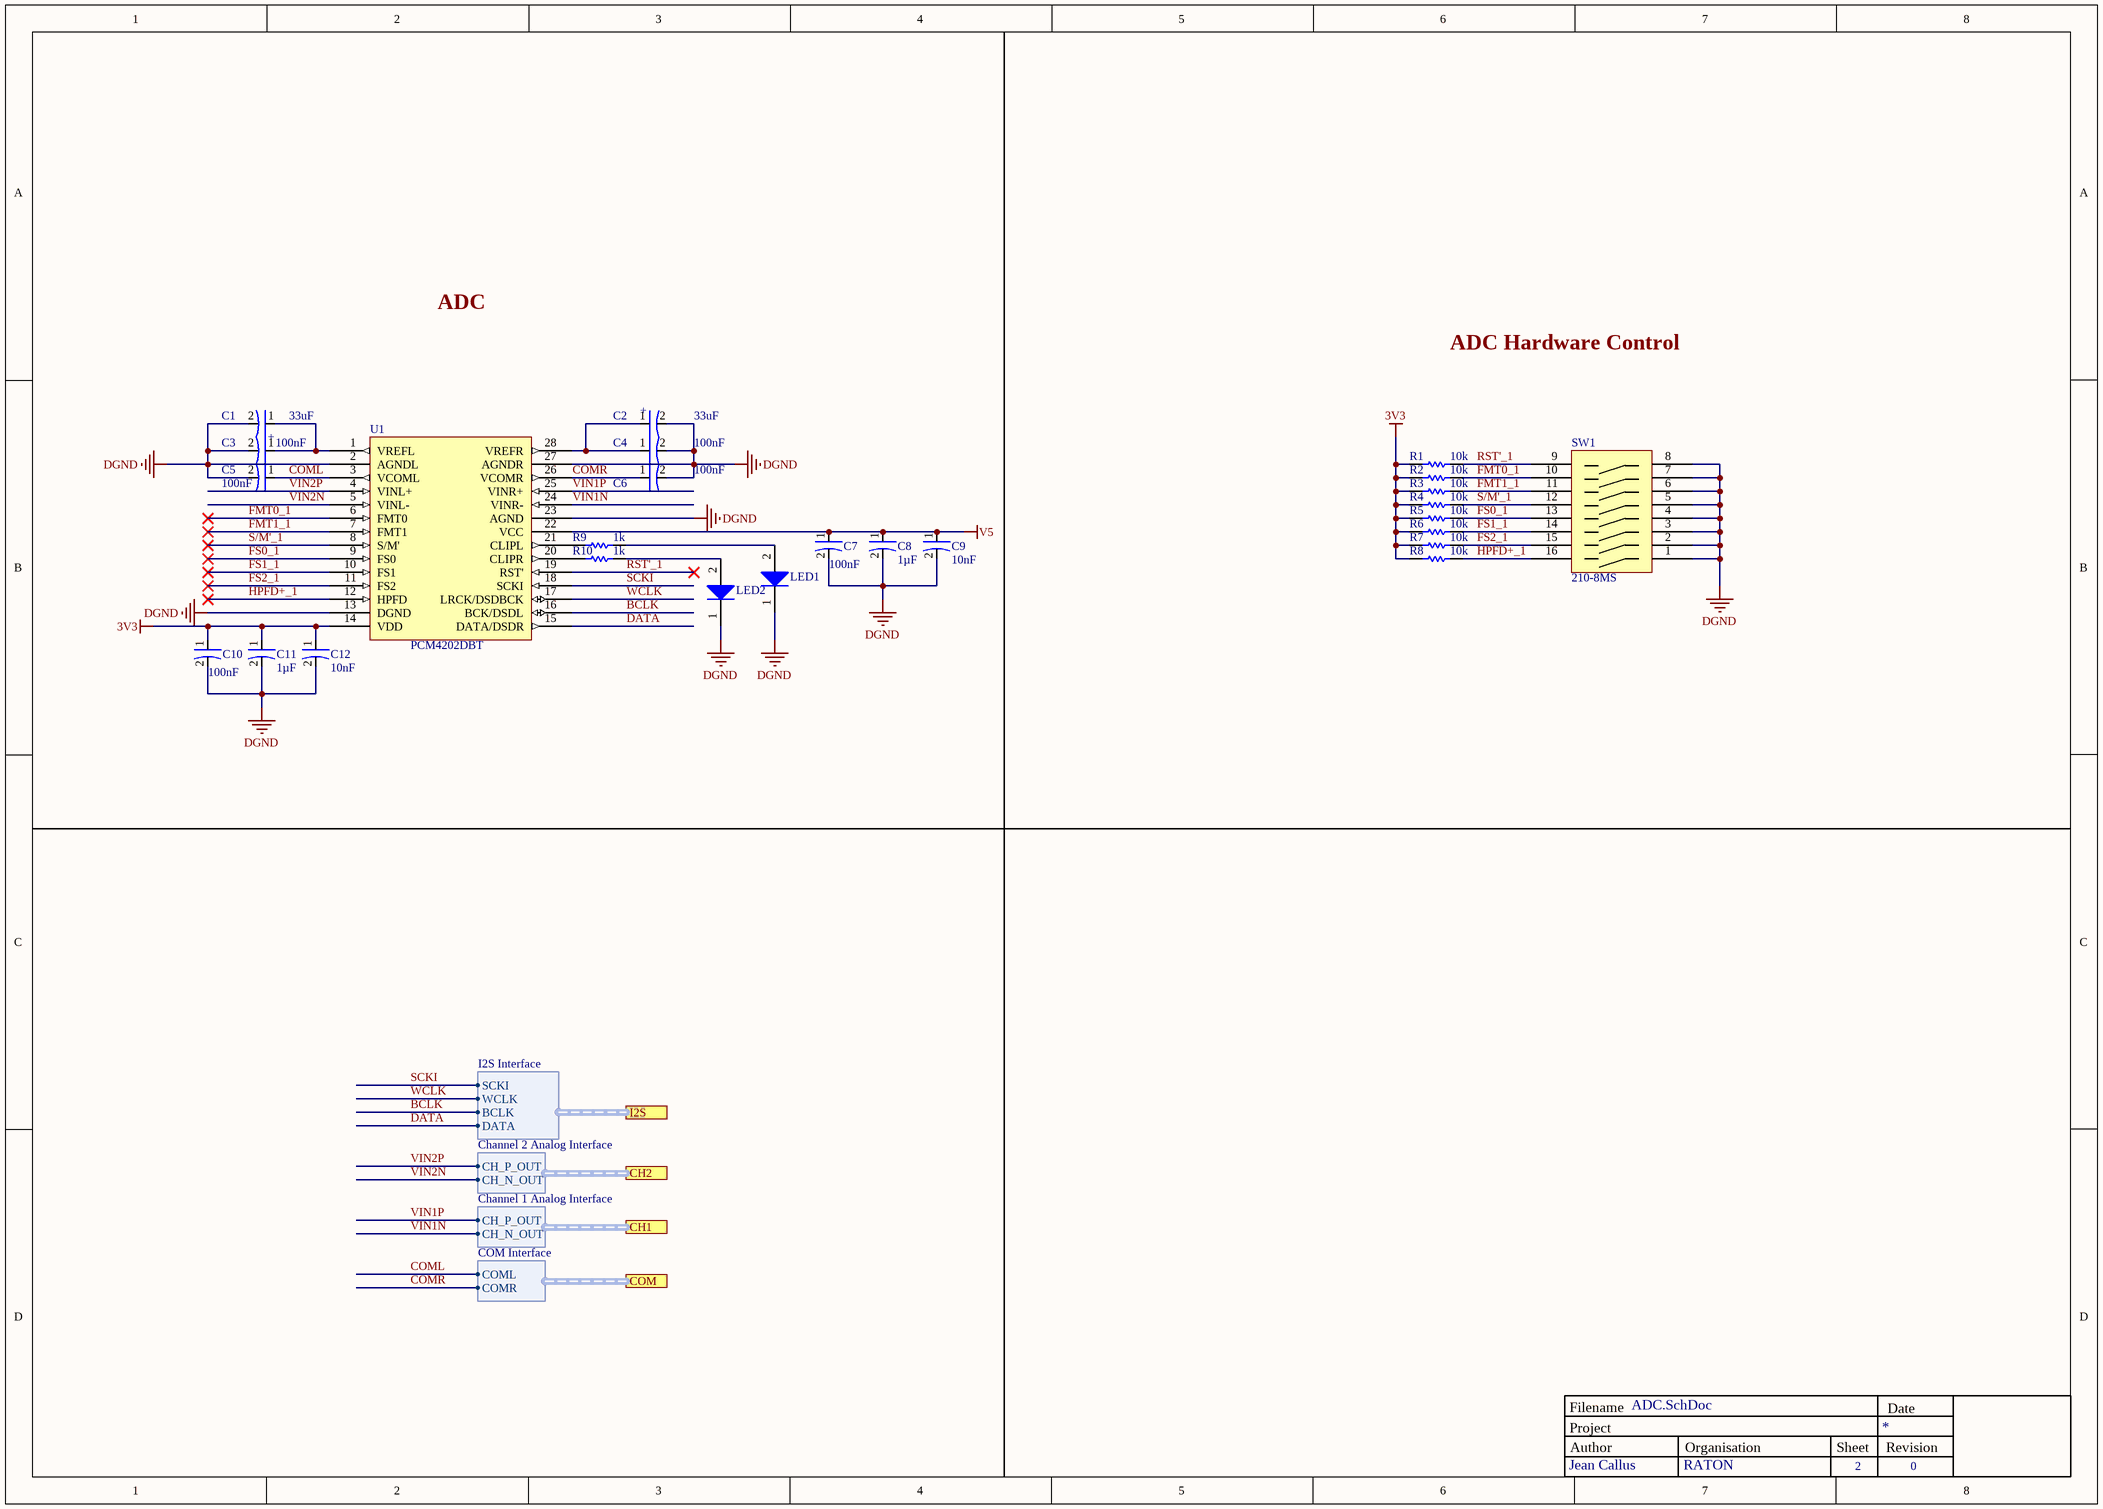
[diagram p2: ADC.SchDoc]

### Parts
C1  value 33uF  [CAPMP6032X26N]  (hidden comment: CAP 33uF TANT C)
C2  value 33uF  [CAPMP6032X26N]  (hidden comment: CAP 33uF TANT C)
C3  value 100nF  [0805-M]  (hidden comment: CAP 0.1uF CER 0805 50V  X7R 5%)
C4  value 100nF  [0805-M]  (hidden comment: CAP 0.1uF CER 0805 50V  X7R 5%)
C5  value 100nF  [0805-M]  (hidden comment: CAP 0.1uF CER 0805 50V  X7R 5%)
C6  value 100nF  [0805-M]  (hidden comment: CAP 0.1uF CER 0805 50V  X7R 5%)
C7  value 100nF  [0805-M]  (hidden comment: CAP 0.1uF CER 0805 50V  X7R 5%)
C8  value 1µF  [0805-L]  (hidden comment: CAP 1uF CER 0805 50V X7R 10%)
C9  value 10nF  [0805-M]  (hidden comment: CAP 10nF CER 0805 50V X7R 10%)
C10  value 100nF  [0805-M]  (hidden comment: CAP 0.1uF CER 0805 50V  X7R 5%)
C11  value 1µF  [0805-L]  (hidden comment: CAP 1uF CER 0805 50V X7R 10%)
C12  value 10nF  [0805-M]  (hidden comment: CAP 10nF CER 0805 50V X7R 10%)
LED1  LED 0603 Red 20mA 1.7V  [0603 Generic]  (value not drawn)
LED2  LED 0603 Red 20mA 1.7V  [0603 Generic]  (value not drawn)
R1  value 10k  [0805-M]  (hidden comment: RES 10k 0805 125mW 1%)
R2  value 10k  [0805-M]  (hidden comment: RES 10k 0805 125mW 1%)
R3  value 10k  [0805-M]  (hidden comment: RES 10k 0805 125mW 1%)
R4  value 10k  [0805-M]  (hidden comment: RES 10k 0805 125mW 1%)
R5  value 10k  [0805-M]  (hidden comment: RES 10k 0805 125mW 1%)
R6  value 10k  [0805-M]  (hidden comment: RES 10k 0805 125mW 1%)
R7  value 10k  [0805-M]  (hidden comment: RES 10k 0805 125mW 1%)
R8  value 10k  [0805-M]  (hidden comment: RES 10k 0805 125mW 1%)
R9  value 1k  [0805-M]  (hidden comment: RES 1k 0805 125mW 5%)
R10  value 1k  [0805-M]  (hidden comment: RES 1k 0805 125mW 5%)
SW1  210-8MS  [210-8MS]
U1  PCM4202DBT  [SOP65P780X200-28N]

### Ports
CH1 (harness Channel 1 Analog Interface), CH2 (harness Channel 2 Analog Interface), COM (harness COM Interface), I2S (harness I2S Interface)

### Harnesses
I2S Interface: SCKI, WCLK, BCLK, DATA
Channel 2 Analog Interface: CH_P_OUT, CH_N_OUT
Channel 1 Analog Interface: CH_N_OUT, CH_P_OUT
COM Interface: COML, COMR

### Nets
3V3: C10.1(Anode) C11.1(Anode) C12.1(Anode) R1.2 R2.2 R3.2 R4.2 R5.2 R6.2 R7.2 R8.2 U1.14(VDD)
DGND: C1.2(Cathode) C2.2(Cathode) C3.2(Cathode) C4.2(Cathode) C5.2(Cathode) C6.2(Cathode) C7.2(Cathode) C8.2(Cathode) C9.2(Cathode) C10.2(Cathode) C11.2(Cathode) C12.2(Cathode) LED1.1 LED2.1 SW1.1(SW1) SW1.2(SW2) SW1.3(SW3) SW1.4(SW4) SW1.5(SW1) SW1.6(SW2) SW1.7 SW1.8(SW4) U1.2(AGNDL) U1.13(DGND) U1.23(AGND) U1.27(AGNDR)
V5: C7.1(Anode) C8.1(Anode) C9.1(Anode) U1.22(VCC)
BCLK: U1.16(BCK/DSDL) ; port I2S.BCLK
COML: C5.1(Anode) U1.3(VCOML) ; port COM.COML
COMR: C6.1(Anode) U1.26(VCOMR) ; port COM.COMR
DATA: U1.15(DATA/DSDR) ; port I2S.DATA
FMT0_1: R2.1 SW1.10(SW3.in) U1.6(FMT0)
FMT1_1: R3.1 SW1.11(SW2.in) U1.7(FMT1)
FS0_1: R5.1 SW1.13(SW4.in) U1.9(FS0)
FS1_1: R6.1 SW1.14(SW3.in) U1.10(FS1)
FS2_1: R7.1 SW1.15(SW2.in) U1.11(FS2)
HPFD+_1: R8.1 SW1.16(SW1) U1.12(HPFD)
RST'_1: R1.1 SW1.9(SW4.in) U1.19(RST')
S/M'_1: R4.1 SW1.12(SW1.in) U1.8(S/M')
SCKI: U1.18(SCKI) ; port I2S.SCKI
VIN1N: U1.24(VINR-) ; port CH1.CH_N_OUT
VIN1P: U1.25(VINR+) ; port CH1.CH_P_OUT
VIN2N: U1.5(VINL-) ; port CH2.CH_N_OUT
VIN2P: U1.4(VINL+) ; port CH2.CH_P_OUT
WCLK: U1.17(LRCK/DSDBCK) ; port I2S.WCLK
NetC1_1: C1.1(Anode) C3.1(Anode) U1.1(VREFL)
NetC2_1: C2.1(Anode) C4.1(Anode) U1.28(VREFR)
NetLED1_2: LED1.2 R9.2
NetLED2_2: LED2.2 R10.2
NetR9_1: R9.1 U1.21(CLIPL)
NetR10_1: R10.1 U1.20(CLIPR)

### Channels
U_ADC: designators end in _1
U_ADC: designators end in _2

### Notes on the sheet
- ADC
- ADC Hardware Control
- Project
- Filename
- Author
- Organisation
- Sheet
- Revision
- Date
  Date
- (in symbol CMP-001-00003-2) +

### Library data of the parts
C1 C2 = CMP-001-00003-2: CAP-33uF-TANT-C; Manufacturer: AVX; Type: SMD; Case/Package: C; Supplier 1: Mouser; ComponentLink1Description: Cap 33uF TANT C; Supplier Part Number: 581-TAJC336K016RNJV; ComponentLink1URL: https://eu.mouser.com/ProductDetail/AVX/TAJC336K016RNJV?qs=YCa%2FAAYMW0021Wdor8g%2FvQ%3D%3D
C3-C7 C10 = CAP 0.1uF CER 0805 50V  X7R 5%-2: as C25 on sheet Analog Front End; Design Item ID: CAP 0.1uF CER 0805 50V  X7R 5%; Supplier 1: Mouser; Datasheet: http://www.kemet.com/Lists/ProductCatalog/Attachments/53/KEM_C1002_X7R_SMD.pdf; Source: Capacitor Library.SchLib; Case/Package: 0805; Status: Active; Supplier Part Number 1: 80-C0805C104J3R
C8 C11 = CAP 1uF CER 0805 50V X7R 10%-2: CAP-1uF-CER-0805-50V-X7R-10%; Manufacturer: Generic; Type: SMD; Bin: F1-C1-05; Supplier Part Number 1: 963-UMK212B7105KG-T; Supplier 1: Mouser; Case/Package: 0805; Source: Capacitor Library.SchLib; Design Item ID: CAP 1uF CER 0805 50V X7R 10%; Status: Active
C9 C12 = CAP 10nF CER 0805 50V X7R 10%-2: CAP-10nF-CER-0805-50V-X7R-10%; Manufacturer: Generic; Type: SMD; Bin: F1-C8-4; Design Item ID: CAP 10nF CER 0805 50V X7R 10%; Supplier 1: Mouser; Case/Package: 0805; Supplier Part Number 1: 81-GRM40X103K50D; Source: Capacitor Library.SchLib
LED1 LED2 = LED 0603 Red 20mA 1.7V-1: as LED5 on sheet Analog Front End; Supplier Part Number 1: 67-1551-6-ND; Design Item ID: LED 0603 Red 20mA 1.7V; Status: Active; Case/Package: 0603; Source: Diode Library.SchLib; Supplier 1: Digi-Key
R1-R8 = RES 10k 0805 125mW 1%-1: as R22 on sheet Analog Front End; Design Item ID: RES 10k 0805 125mW 1%; Case/Package: 0805; Type: SMD; Status: Active; Source: Resistor Library.SchLib
R9 R10 = RES 1k 0805 125mW 5%-1: as R15 on sheet Analog Front End; Design Item ID: RES 1k 0805 125mW 5%; Case/Package: 0805; Status: Active; Source: Resistor Library.SchLib; Type: SMD
SW1 = 210-8MS-2: SWITCH DIP SMD SPST 8 100mA 50V; Manufacturer: C&K Components; Supplier Part Number 1: 774-2108MS; Design Item ID: 210-8MS; Source: Switches Library.SchLib; Case/Package: 16 PDIP; Supplier 1: Mouser; Status: Active; Type: TH
U1 = CMP-019-00000-3: Analogue to Digital Converter, Dual, 24 bit, 216 kSPS, Single, 4.75 V, 5.25 V, SSOP ;RoHS Compliant: Yes; Number of A/D Converters: 2; Polarity: Bipolar; Power Dissipation: 408mW; Operating Supply Voltage: 5V; Conversion Rate: 216KS/s; Min Supply Voltage: 4.75V; Resolution: 24b; Number of Analog Inputs: 1; Number of DAC Channels: 0; Interface: Serial; Supply Type: Analog,Digital; Max Supply Voltage: 5.25V; Nominal Supply Current: 55mA; Number of Bits: 24; Power Consumption: 338mW; Case/Package: SSOP; Length: 10.2mm; Width: 5.3mm; Number of Pins: 28; Mount: Surface Mount; Height: 1.95mm; REACH SVHC: No SVHC; Lead Free: Lead Free; Min Operating Temperature: -10°C; Weight: 0.008529oz; Sampling Rate: 216KS/s; Package Quantity: 250; Number of ADC Channels: 2; Number of Elements: 2; Radiation Hardening: No; Max Power Dissipation: 408mW; Max Operating Temperature: 70°C; Number of Converters: 2; Packaging: Tape and Reel

## Sheet Power.SchDoc
size A3; Author: Jean Callus; DrawnBy: Jean Callus; Organization: RATON; Revision: 0; SheetNumber: 3
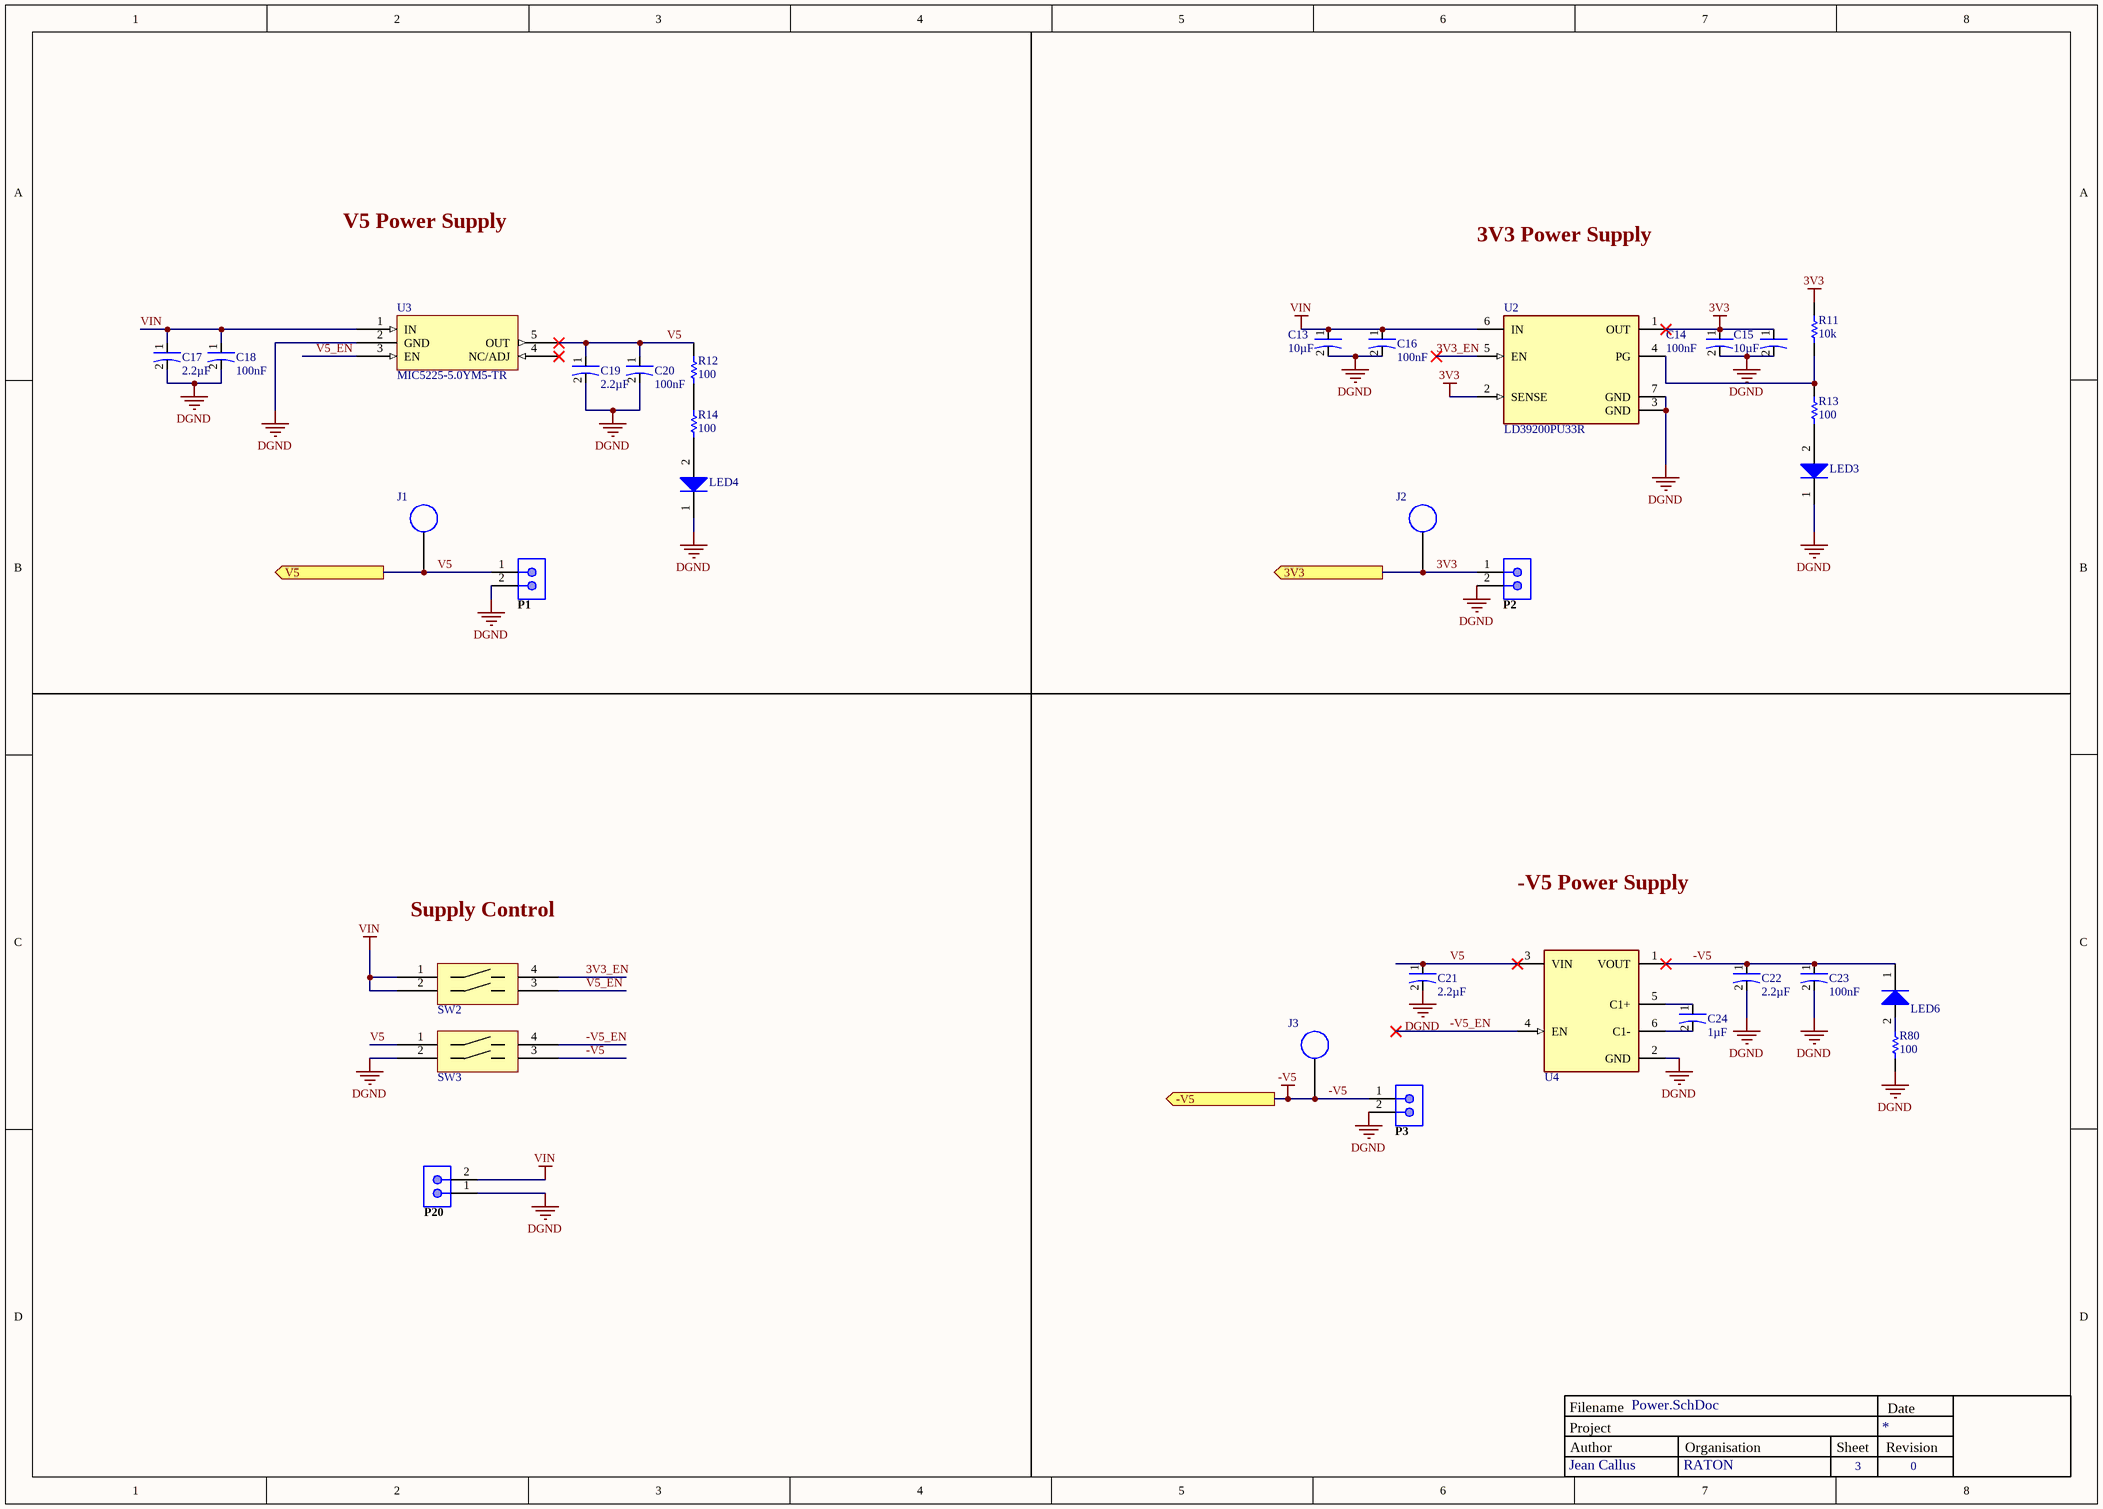
[diagram p3: Power.SchDoc]

### Parts
C13  value 10µF  [0402-M]  (hidden comment: CAP 10uF CER 0402 6.3V X5R 20%)
C14  value 100nF  [0805-M]  (hidden comment: CAP 0.1uF CER 0805 50V X7R 10%)
C15  value 10µF  [0402-M]  (hidden comment: CAP 10uF CER 0402 6.3V X5R 20%)
C16  value 100nF  [0805-M]  (hidden comment: CAP 0.1uF CER 0805 50V X7R 10%)
C17  value 2.2µF  [0402-M]  (hidden comment: CAP 2.2uF CER 0402 25V X5R 10%)
C18  value 100nF  [0805-M]  (hidden comment: CAP 0.1uF CER 0805 50V X7R 10%)
C19  value 2.2µF  [0402-M]  (hidden comment: CAP 2.2uF CER 0402 25V X5R 10%)
C20  value 100nF  [0805-M]  (hidden comment: CAP 0.1uF CER 0805 50V X7R 10%)
C21  value 2.2µF  [0402-M]  (hidden comment: CAP 2.2uF CER 0402 25V X5R 10%)
C22  value 2.2µF  [0402-M]  (hidden comment: CAP 2.2uF CER 0402 25V X5R 10%)
C23  value 100nF  [0805-M]  (hidden comment: CAP 0.1uF CER 0805 50V X7R 10%)
C24  value 1µF  [0402-M]  (hidden comment: CAP 1uF CER 0402 25V X5R 20%)
J1  151-203-RC  [151-203-RC-Footprint-1]  (value not drawn)
J2  151-203-RC  [151-203-RC-Footprint-1]  (value not drawn)
J3  151-203-RC  [151-203-RC-Footprint-1]  (value not drawn)
LED3  LED 0603 Green 20mA 1.8V  [0603 Generic]  (value not drawn)
LED4  LED 0603 Green 20mA 1.8V  [0603 Generic]  (value not drawn)
LED6  LED 0603 Green 20mA 1.8V  [0603 Generic]  (value not drawn)
P1  GENERIC 2PIN HEADER MALE  [GENERIC 2PIN HEADER 0]  (value not drawn)
P2  GENERIC 2PIN HEADER MALE  [GENERIC 2PIN HEADER 0]  (value not drawn)
P3  GENERIC 2PIN HEADER MALE  [GENERIC 2PIN HEADER 0]  (value not drawn)
P20  GENERIC 2PIN HEADER MALE  [GENERIC 2PIN HEADER 0]  (value not drawn)
R11  value 10k  [0402-M]  (hidden comment: RES 10k 0402 63mW 5%)
R12  value 100  [0805-L]  (hidden comment: RES 100 0805 125mW 1%)
R13  value 100  [0805-L]  (hidden comment: RES 100 0805 125mW 1%)
R14  value 100  [0805-L]  (hidden comment: RES 100 0805 125mW 1%)
R80  value 100  [0805-L]  (hidden comment: RES 100 0805 125mW 1%)
SW2  210-2MS  [210-2MS-Footprint-1]  (value not drawn)
SW3  210-2MS  [210-2MS-Footprint-1]  (value not drawn)
U2  LD39200PU33R  [FP-DFN6-7946637-MFG]
U3  MIC5225-5.0YM5-TR  [SOT95P280X145-5N]
U4  LM2776DBVR  [FP-DBV0006A-IPC_B]  (value not drawn)

### Ports
3V3 (out), -V5 (out), V5 (out)

### Nets
3V3: C14.1(Anode) C15.1(Anode) J2.1 P2.1 R11.2 U2.1(OUT) U2.2(SENSE) ; port 3V3
-V5: C22.1(Anode) C23.1(Anode) J3.1 LED6.1 P3.1 SW3.3 U4.1(VOUT) ; port -V5
DGND: C13.2(Cathode) C14.2(Cathode) C15.2(Cathode) C16.2(Cathode) C17.2(Cathode) C18.2(Cathode) C19.2(Cathode) C20.2(Cathode) C21.2(Cathode) C22.2(Cathode) C23.2(Cathode) LED3.1 LED4.1 P1.2 P2.2 P3.2 P20.1 R80.1 SW3.2 U2.3(GND) U2.7(GND) U3.2(GND) U4.2(GND)
V5: C19.1(Anode) C20.1(Anode) C21.1(Anode) J1.1 P1.1 R12.2 SW3.1 U3.5(OUT) U4.3(VIN) ; port V5
VIN: C13.1(Anode) C16.1(Anode) C17.1(Anode) C18.1(Anode) P20.2 SW2.1 SW2.2 U2.6(IN) U3.1(IN)
3V3_EN: SW2.4 U2.5(EN)
-V5_EN: SW3.4 U4.4(EN)
V5_EN: SW2.3 U3.3(EN)
NetC24_1: C24.1(Anode) U4.5(C1+)
NetC24_2: C24.2(Cathode) U4.6(C1-)
NetLED3_2: LED3.2 R13.1
NetLED4_2: LED4.2 R14.1
NetLED6_2: LED6.2 R80.2
NetR11_1: R11.1 R13.2 U2.4(PG)
NetR12_1: R12.1 R14.2

Not connected (* = marked no-connect by the designer): U3 4(NC/ADJ)*

### Notes on the sheet
- V5 Power Supply
- 3V3 Power Supply
- Supply Control
- -V5 Power Supply
- Project
- Filename
- Author
- Organisation
- Sheet
- Revision
- Date
  Date

### Library data of the parts
C13 C15 = CAP 10uF CER 0402 6.3V X5R 20%-2: CAP-10uF-CER-0402-6.3V-X5R-20%; Manufacturer: Generic; Type: SMD; Bin: F1-C2-10; Supplier Part Number 1: 80-C0402C106M9P; Source: Capacitor Library.SchLib; Case/Package: 0402; Supplier 1: Mouser; Design Item ID: CAP 10uF CER 0402 6.3V X5R 20%
C14 C16 C18 C20 C23 = CAP 0.1uF CER 0805 50V X7R 10%-2: CAP-0.1uF-CER-0805-50V-X7R-10%; Manufacturer: Generic; Bin: 8-CAP; Type: SMD; Source: Capacitor Library.SchLib; Status: Active; Design Item ID: CAP 0.1uF CER 0805 50V X7R 10%; Supplier 1: Mouser; Supplier Part Number 1: 80-C0805C104K5R; Case/Package: 0805; Datasheet: http://www.kemet.com/Lists/ProductCatalog/Attachments/53/KEM_C1002_X7R_SMD.pdf
C17 C19 C21 C22 = CAP 2.2uF CER 0402 25V X5R 10%-2: CAP-2.2uF-CER-0402-25V-X5R-10%; Manufacturer: Generic; Bin: F1-C1-9; Type: SMD; Supplier Part Number 1: 810-C1005X5R1E225K; Status: Active; Supplier 1: Mouser; Source: Capacitor Library.SchLib; Design Item ID: CAP 2.2uF CER 0402 25V X5R 10%; Case/Package: 0402
C24 = CAP 1uF CER 0402 25V X5R 20%-2: CAP-1uF-CER-0402-25V-X5R-20%; Manufacturer: Generic; Bin: 5-FMC-CAP; Type: SMD; Design Item ID: CAP 1uF CER 0402 25V X5R 20%; Source: Capacitor Library.SchLib; Supplier 1: Mouser; Status: Active; Supplier Part Number 1: 963-TMK105CC6105MV-F; Case/Package: 0402
J1-J3 = CMP-002-00000-2: PCB-Probe-Ring; Color: Black
LED3 LED4 LED6 = LED 0603 Green 20mA 1.8V-1: LED-0603-Green-20mA-1.8V-STOCK; Manufacturer: Generic; Bin: F2-DM1-1; Type: SMD; Design Item ID: LED 0603 Green 20mA 1.8V; Status: Active; Supplier 1: Mouser; Supplier Part Number 1: 645-598-8060-107F; Case/Package: 0603; Source: Diode Library.SchLib
P1-P3 P20 = GENERIC 2PIN HEADER MALE-2: CONN MAL TH 2 0Deg HEADER; Bin: B3-J5; Manufacturer: Generic; Design Item ID: GENERIC 2PIN HEADER MALE; Type: TH; Status: Active; Source: Connector Library.SchLib; Case/Package: n/a PIN
R11 = RES 10k 0402 63mW 5%-1: as R45 on sheet ADC Board TOP; Design Item ID: RES 10k 0402 63mW 5%; Type: SMD; Status: Active; Case/Package: 0402; Source: Resistor Library.SchLib
R12-R14 R80 = RES 100 0805 125mW 1%-1: RES-100-0805-125mW-1%; Manufacturer: Generic; Bin: F1-R11-6; MAPPING: 1(2,1,10k); Status: Active; Case/Package: 0805; Source: Resistor Library.SchLib; Type: SMD; Design Item ID: RES 100 0805 125mW 1%
SW2 SW3 = CMP-01293-3: as SW4 on sheet Analog Front End; Terminal Pitch: 2.54mm; Contact Material: Copper; Length: 0.258inch; Termination: PC Pin; Lead Free: Lead Free; Max Current Rating: 100mA; Throw Configuration: SPST; Packaging: Rail/Tube; Current Rating: 100mA; Orientation: Straight; Min Operating Temperature: -40°C; Contact Plating: Gold,Tin; Max Operating Temperature: 85°C; Package Quantity: 85; Mount: Through Hole
U2 = CMP-01296-4: STMICROELECTRONICS - LD39200PU33R - LDO, FIXED, 3.3V, 2A, -40 TO 125DEG C; Bin: NR; Case/Package: 6-pin DFN; Status: NR; Manufacturer: STMicroelectronics; Type: SMD; Supplier Part Number1: NR; Supplier1: NR
U3 = CMP-01298-2: MICROCHIP - MIC5225-5.0YM5-TR - Fixed LDO Voltage Regulator, 2.3V to 16V, 310mV Dropout, 5Vout, 150mAout, SOT-23-5; Bin: NR; Case/Package: SOT-23-5; Datasheet: NR; Manufacturer: Microchip; Status: NR; Supplier1: NR; Supplier Part Number1: NR; Type: SMD
U4 = LM2776DBVR-7: Charge Pump Negative Voltage; Manufacturer: Texas Instruments; Case/Package: 6 SOT-23; Status: Active; Type: SMD

## Nets that join several sheets
3V3: ADC Board TOP (15 pins), U_Analog Front End (C37_1.1 C38_1.1 U7_1.6), U_ADC (12 pins), U_Analog Front End (C37_2.1 C38_2.1 U7_2.6), Power (7 pins), U_Analog Front End (C37_3.1 C38_3.1 U7_3.6), U_ADC (12 pins), U_Analog Front End (C37_4.1 C38_4.1 U7_4.6)
-V5: U_Analog Front End (12 pins), U_Analog Front End (12 pins), Power (7 pins), U_Analog Front End (12 pins), U_Analog Front End (12 pins)
DGND: ADC Board TOP (17 pins), U_Analog Front End (44 pins), U_ADC (26 pins), U_Analog Front End (44 pins), Power (23 pins), U_Analog Front End (44 pins), U_ADC (26 pins), U_Analog Front End (44 pins)
V5: U_Analog Front End (22 pins), U_ADC (C7_1.1 C8_1.1 C9_1.1 U1_1.22), U_Analog Front End (22 pins), Power (9 pins), U_Analog Front End (22 pins), U_ADC (C7_2.1 C8_2.1 C9_2.1 U1_2.22), U_Analog Front End (22 pins)
A0: ADC Board TOP (R45.1 R48.2), U_Analog Front End (U7_1.3)
A0: ADC Board TOP (R51.1 R54.2), U_Analog Front End (U7_2.3)
A0: ADC Board TOP (R57.1 R60.2), U_Analog Front End (U7_3.3)
A0: ADC Board TOP (R63.1 R66.2), U_Analog Front End (U7_4.3)
A1: ADC Board TOP (R46.1 R49.2), U_Analog Front End (U7_1.2)
A1: ADC Board TOP (R52.1 R55.2), U_Analog Front End (U7_2.2)
A1: ADC Board TOP (R58.1 R61.2), U_Analog Front End (U7_3.2)
A1: ADC Board TOP (R64.1 R67.2), U_Analog Front End (U7_4.2)
A2: ADC Board TOP (R47.1 R50.2), U_Analog Front End (U7_1.1)
A2: ADC Board TOP (R53.1 R56.2), U_Analog Front End (U7_2.1)
A2: ADC Board TOP (R59.1 R62.2), U_Analog Front End (U7_3.1)
A2: ADC Board TOP (R65.1 R68.2), U_Analog Front End (U7_4.1)
BCLK: ADC Board TOP (J22.2 P19.5), U_ADC (U1_2.16)
BCLK: ADC Board TOP (J22.5 P19.6), U_ADC (U1_1.16)
CH_OUT_N_N: U_Analog Front End (J19_1.1 P18_1.1), U_ADC (U1_1.24)
CH_OUT_N_N: U_ADC (U1_1.5), U_Analog Front End (J19_2.1 P18_2.1)
CH_OUT_N_N: U_Analog Front End (J19_3.1 P18_3.1), U_ADC (U1_2.24)
CH_OUT_N_N: U_ADC (U1_2.5), U_Analog Front End (J19_4.1 P18_4.1)
CH_OUT_N_P: U_Analog Front End (J17_1.1 P16_1.2), U_ADC (U1_1.25)
CH_OUT_N_P: U_ADC (U1_1.4), U_Analog Front End (J17_2.1 P16_2.2)
CH_OUT_N_P: U_Analog Front End (J17_3.1 P16_3.2), U_ADC (U1_2.25)
CH_OUT_N_P: U_ADC (U1_2.4), U_Analog Front End (J17_4.1 P16_4.2)
COM: U_Analog Front End (J5_1.1 P5_1.2), U_ADC (C5_1.1 U1_1.3)
COM: U_ADC (C6_1.1 U1_1.26), U_Analog Front End (J5_2.1 P5_2.2)
COM: U_Analog Front End (J5_3.1 P5_3.2), U_ADC (C5_2.1 U1_2.3)
COM: U_ADC (C6_2.1 U1_2.26), U_Analog Front End (J5_4.1 P5_4.2)
DATA: ADC Board TOP (J22.3 P19.7), U_ADC (U1_2.15)
DATA: ADC Board TOP (J22.6 P19.8), U_ADC (U1_1.15)
SCKI: ADC Board TOP (J22.9 P19.1), U_ADC (U1_2.18)
SCKI: ADC Board TOP (J22.7 P19.2), U_ADC (U1_1.18)
SCL: ADC Board TOP (J22.15 R81.1), U_Analog Front End (SW4_1.2), U_Analog Front End (SW4_2.2), U_Analog Front End (SW4_3.2), U_Analog Front End (SW4_4.2)
SDA: ADC Board TOP (J22.16 R82.1), U_Analog Front End (U7_1.5), U_Analog Front End (U7_2.5), U_Analog Front End (U7_3.5), U_Analog Front End (U7_4.5)
WCLK: ADC Board TOP (J22.1 P19.3), U_ADC (U1_2.17)
WCLK: ADC Board TOP (J22.4 P19.4), U_ADC (U1_1.17)

## Assembly variants
Normal: not fitted R? R? R? R? R? R? R? R? R? R? R? R? R?_U_Analog Front End1